# Altium project ZB.PrjPCB
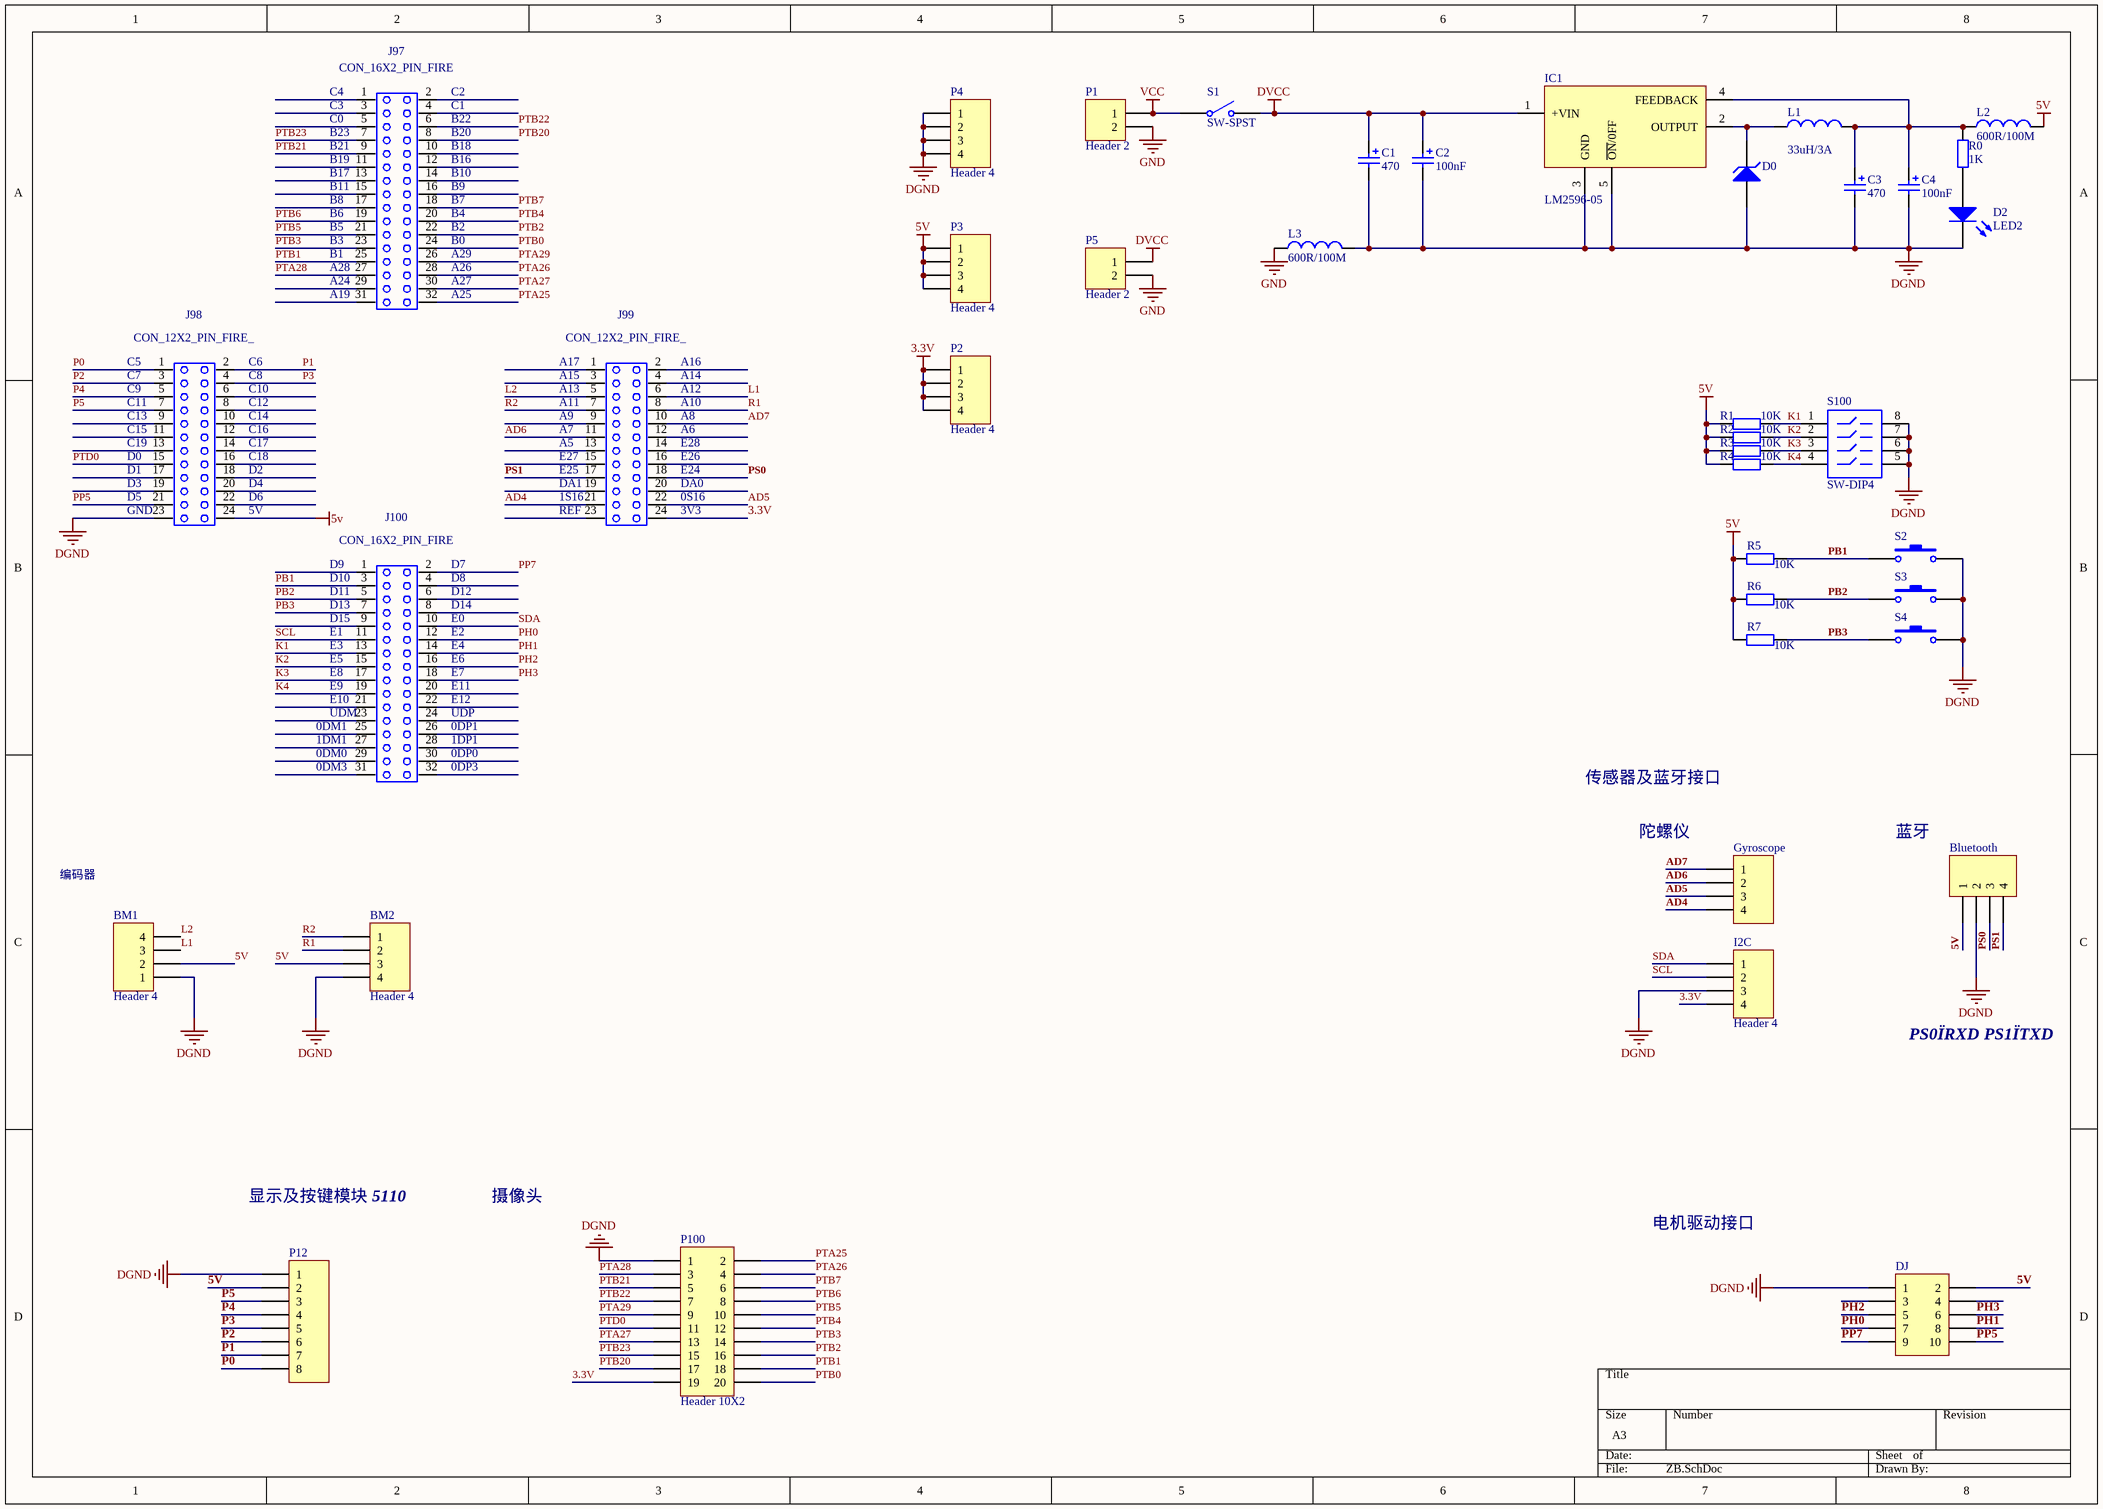
[diagram p0: ZB.SchDoc]
1 sheet, 40 parts. Net scope: global (net labels, ports and power ports of the same name join across sheets).
Board file: ZB.PcbDoc

## Sheet ZB.SchDoc
size A3

### Parts
Bluetooth  Header 4  [HDR1X4]  (value not drawn)
BM1  Header 4  [HDR1X4]
BM2  Header 4  [HDR1X4]
C1  470  [ccc]
C2  value 100nF  [C0805]
C3  470  [ccc]
C4  value 100nF  [C0805]
D0  D Zener  [D1810]  (value not drawn)
D2  LED2  [D0805]
DJ  Header 5X2  [HDR2X5]  (value not drawn)
Gyroscope  Header 4  [HDR1X4]  (value not drawn)
I2C  Header 4  [HDR1X4]
IC1  LM2596-05  [TO-263-5]
J97  CON_16X2_PIN_FIRE  [CON-16X2-2.54]
J98  CON_12X2_PIN_FIRE_  [CON-12X2-2.54]
J99  CON_12X2_PIN_FIRE_  [CON-12X2-2.54]
J100  CON_16X2_PIN_FIRE  [CON-16X2-2.54]
L1  value 33uH/3A  [L-12*12MM-S]  (hidden comment: Inductor)
L2  value 600R/100M  [L1206]  (hidden comment: Inductor)
L3  value 600R/100M  [L1206]  (hidden comment: Inductor)
P1  Header 2  [SIP2-1]
P2  Header 4  [HDR1X4]
P3  Header 4  [HDR1X4]
P4  Header 4  [HDR1X4]
P5  Header 2  [SIP2-1]
P12  Header 8  [HDR1X8]  (value not drawn)
P100  Header 10X2  [HDR2X10]
R0  value 1K  [R0805]  (hidden comment: Res2)
R1  value 10K  [C0805]  (hidden comment: Res2)
R2  value 10K  [C0805]  (hidden comment: Res2)
R3  value 10K  [C0805]  (hidden comment: Res2)
R4  value 10K  [C0805]  (hidden comment: Res2)
R5  value 10K  [C0805]  (hidden comment: Res2)
R6  value 10K  [C0805]  (hidden comment: Res2)
R7  value 10K  [C0805]  (hidden comment: Res2)
S1  SW-SPST  [PCBComponent_1]
S2  SW-PB  [白色按键]  (value not drawn)
S3  SW-PB  [白色按键]  (value not drawn)
S4  SW-PB  [白色按键]  (value not drawn)
S100  SW-DIP4  [DIP-8]

### Nets
3.3V: I2C.4 J99.24 P2.1 P2.2 P2.3 P2.4 P100.19
5V: Bluetooth.1 BM1.2 BM2.3 DJ.2 J98.24 L2.2 P3.1 P3.2 P3.3 P3.4 P12.2 R1.1 R2.1 R3.1 R4.1 R5.1 R6.1 R7.1
DGND: Bluetooth.2 BM1.1 BM2.4 C1.2 C2.2 C3.2 C4.2 D0.1(A) D2.2(K) DJ.1 I2C.3 IC1.3(GND) IC1.5(~{ON}/0FF) J98.23 L3.2 P4.1 P4.2 P4.3 P4.4 P12.1 P100.1 S2.2 S3.2 S4.2 S100.5 S100.6 S100.7 S100.8
DVCC: C1.1 C2.1 IC1.1(+VIN) P5.1 S1.2(NO)
GND: L3.1 P1.2 P5.2
VCC: P1.1 S1.1(COMMON)
AD4: Gyroscope.4 J99.21
AD5: Gyroscope.3 J99.22
AD6: Gyroscope.2 J99.11
AD7: Gyroscope.1 J99.10
K1: J100.13 R1.2 S100.1
K2: J100.15 R2.2 S100.2
K3: J100.17 R3.2 S100.3
K4: J100.19 R4.2 S100.4
L1: BM1.3 J99.6
L2: BM1.4 J99.5
P0: J98.1 P12.8
P1: J98.2 P12.7
P2: J98.3 P12.6
P3: J98.4 P12.5
P4: J98.5 P12.4
P5: J98.7 P12.3
PB1: J100.3 R5.2 S2.1
PB2: J100.5 R6.2 S3.1
PB3: J100.7 R7.2 S4.1
PH0: DJ.7 J100.12
PH1: DJ.8 J100.14
PH2: DJ.5 J100.16
PH3: DJ.6 J100.18
PP5: DJ.10 J98.21
PP7: DJ.9 J100.2
PS0: Bluetooth.3 J99.18
PS1: Bluetooth.4 J99.17
PTA25: J97.32 P100.2
PTA26: J97.28 P100.4
PTA27: J97.30 P100.13
PTA28: J97.27 P100.3
PTA29: J97.26 P100.9
PTB0: J97.24 P100.20
PTB1: J97.25 P100.18
PTB2: J97.22 P100.16
PTB3: J97.23 P100.14
PTB4: J97.20 P100.12
PTB5: J97.21 P100.10
PTB6: J97.19 P100.8
PTB7: J97.18 P100.6
PTB20: J97.8 P100.17
PTB21: J97.9 P100.5
PTB22: J97.6 P100.7
PTB23: J97.7 P100.15
PTD0: J98.15 P100.11
R1: BM2.2 J99.8
R2: BM2.1 J99.7
SCL: I2C.2 J100.11
SDA: I2C.1 J100.10
NetC3_1: C3.1 C4.1 IC1.4(FEEDBACK) L1.2 L2.1 R0.1
NetD0_2: D0.2(K) IC1.2(OUTPUT) L1.1
NetD2_1: D2.1(A) R0.2

Not connected (* = marked no-connect by the designer): DJ 3 4; J97 1 2 3 4 5 10 11 12 13 14 15 16 17 29 31; J98 6 8 9 10 11 12 13 14 16 17 18 19 20 22; J99 1 2 3 4 9 12 13 14 15 16 19 20 23; J100 1 4 6 8 9 20 21 22 23 24 25 26 27 28 29 30 31 32

### Notes on the sheet
- (near J97) C3
- (near J97) C4
- (near J97) C2
- (near J97) C1
- (near J97) C0
- (near J97) B17
- (near J97) B19
- (near J97) B21
- (near J97) B23
- (near J97) B10
- (near J97) B16
- (near J97) B18
- (near J97) B20
- (near J97) B22
- (near J97) B3
- (near J97) B5
- (near J97) B6
- (near J97) B8
- (near J97) B11
- (near J97) B0
- (near J97) B2
- (near J97) B4
- (near J97) B7
- (near J97) B9
- (near J97) B1
- (near J97) A19
- (near J97) A24
- (near J97) A28
- (near J97) A25
- (near J97) A26
- (near J97) A27
- (near J97) A29
- (near J98) C5
- (near J98) C7
- (near J98) C6
- (near J98) C8
- (near J99) A15
- (near J99) A17
- (near J99) A14
- (near J99) A16
- (near J98) C9
- (near J98) C11
- (near J98) C13
- (near J98) C15
- (near J98) C19
- (near J98) C10
- (near J98) C12
- (near J98) C14
- (near J98) C16
- (near J98) C17
- (near J99) A5
- (near J99) A7
- (near J99) A9
- (near J99) A11
- (near J99) A13
- (near J99) E28
- (near J99) A6
- (near J99) A8
- (near J99) A10
- (near J99) A12
- (near J98) D0
- (near J98) D1
- (near J98) D3
- (near J98) D5
- (near J98) GND
- (near J98) C18
- (near J98) D2
- (near J98) D4
- (near J98) D6
- (near J98) 5V
- (near J99) REF
- (near J99) 1S16
- (near J99) DA1
- (near J99) E25
- (near J99) E27
- (near J99) 3V3
- (near J99) 0S16
- (near J99) DA0
- (near J99) E24
- (near J99) E26
- (near J100) D9
- (near J100) D10
- (near J100) D7
- (near J100) D8
- (near J100) D11
- (near J100) D13
- (near J100) D15
- (near J100) E1
- (near J100) E3
- (near J100) D12
- (near J100) D14
- (near J100) E0
- (near J100) E2
- (near J100) E4
- (near J100) E5
- (near J100) E8
- (near J100) E9
- (near J100) E10
- (near J100) UDM
- (near J100) E6
- (near J100) E7
- (near J100) E11
- (near J100) E12
- (near J100) UDP
- (near J100) 0DM0
- (near J100) 0DM1
- (near J100) 1DM1
- (near J100) 0DM3
- (near J100) 1DP1
- (near J100) 0DP1
- (near J100) 0DP0
- (near J100) 0DP3
- 传感器及蓝牙接口
- 陀螺仪
- 蓝牙
- 编码器
- PS0ΪRXD PS1ΪTXD
- 显示及按键模块 5110
- 摄像头
- 电机驱动接口

### Library data of the parts
Bluetooth BM1 BM2 Gyroscope I2C P2-P4 = Header 4: Header, 4-Pin; LatestRevisionDate: 17-Jul-2002; LatestRevisionNote: Re-released for DXP Platform.; Publisher: Altium Limited
C1 C3 = Cap Pol2: Polarized Capacitor (Axial); Value: 100pF; Published: 8-Jun-2000; LatestRevisionDate: 17-Jul-2002; LatestRevisionNote: Re-released for DXP Platform.; PackageReference: POLAR0.8; Publisher: Altium Limited
C2 C4 = Cap Pol2: Polarized Capacitor (Axial); Published: 8-Jun-2000; LatestRevisionDate: 17-Jul-2002; LatestRevisionNote: Re-released for DXP Platform.; PackageReference: POLAR0.8; Publisher: Altium Limited
D0 = D Zener: Zener Diode; Published: 8-Jun-2000; LatestRevisionDate: 17-Jul-2002; LatestRevisionNote: Re-released for DXP Platform.; PackageReference: DIODE-0.7; Publisher: Altium Limited
D2 = LED2: Typical RED, GREEN, YELLOW, AMBER GaAs LED; Published: 8-Jun-2000; LatestRevisionDate: 17-Jul-2002; LatestRevisionNote: Re-released for DXP Platform.; PackageVersion: Feb-2002; PackageReference: 3.2X1.6X1.1; Publisher: Altium Limited
DJ = Header 5X2: Header, 5-Pin, Dual row; LatestRevisionDate: 17-Jul-2002; LatestRevisionNote: Re-released for DXP Platform.; Publisher: Altium Limited
J97 J100 = CON_16X2_PIN_FIRE: 16X2,pin,2.54mm; PCB DECAL: CON-16X2-2.54
J98 J99 = CON_12X2_PIN_FIRE_: 12X2,pin,2.54mm; PCB DECAL: CON-12X2-2.54
L1-L3 = Inductor: Code_IEC: 1005; Published: 8-Jun-2000; LatestRevisionDate: 29-May-2009; LatestRevisionNote: IPC-7351 Footprint Added.; PackageReference: 0402-A; Publisher: Altium Limited; PackageDescription: Chip Inductor; Code_JEITA: 0402
P1 P5 = Header 2: Header, 2-Pin; LatestRevisionDate: 17-Jul-2002; LatestRevisionNote: Re-released for DXP Platform.; Publisher: Altium Limited
P12 = Header 8: Header, 8-Pin; LatestRevisionDate: 17-Jul-2002; LatestRevisionNote: Re-released for DXP Platform.; Publisher: Altium Limited
P100 = Header 10X2: Header, 10-Pin, Dual row; LatestRevisionDate: 17-Jul-2002; LatestRevisionNote: Re-released for DXP Platform.; Publisher: Altium Limited
R0-R7 = Res2: Resistor; Published: 8-Jun-2000; LatestRevisionDate: 17-Jul-2002; LatestRevisionNote: Re-released for DXP Platform.; PackageReference: AXIAL-0.4; Publisher: Altium Limited
S1 = SW-SPST: Single-Pole, Single-Throw Switch; Published: 24-Mar-1999; LatestRevisionDate: 17-Jul-2002; LatestRevisionNote: Re-released for DXP Platform.; PackageReference: SPST-2; Publisher: Altium Limited
S2-S4 = SW-PB: Switch; Published: 24-Mar-1999; LatestRevisionDate: 17-Jul-2002; LatestRevisionNote: Re-released for DXP Platform.; PackageReference: SPST-2; Publisher: Altium Limited
S100 = SW-DIP4: DIP Switch; Published: 24-Mar-1999; LatestRevisionDate: 17-Jul-2002; LatestRevisionNote: Re-released for DXP Platform.; PackageReference: DIP-8; Publisher: Altium Limited